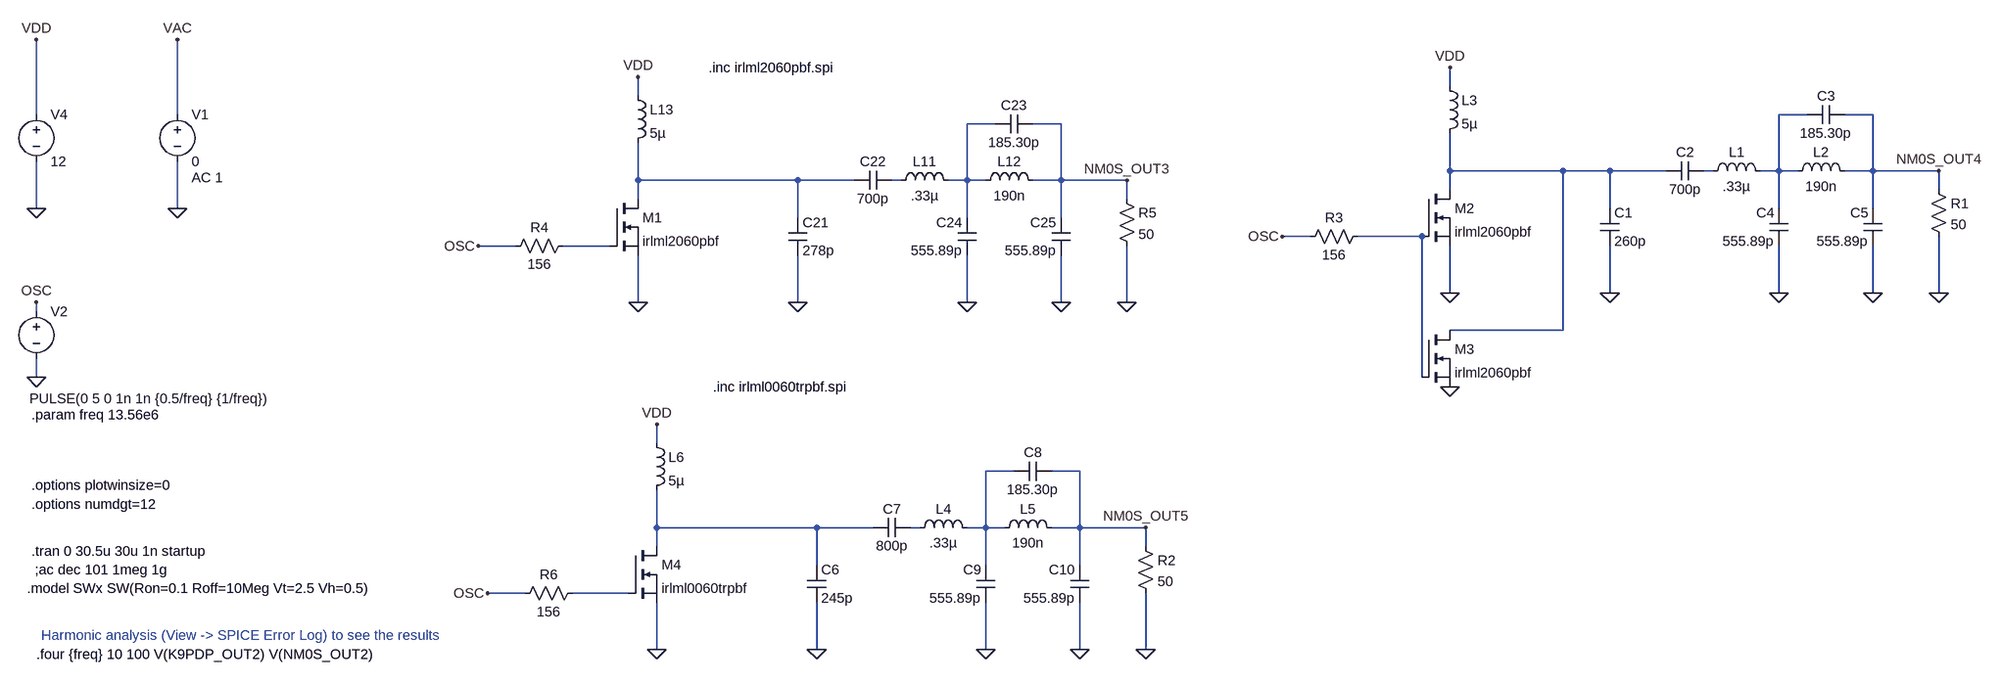
[diagram p0: schematic Class_E_with_transistor.asc]
Class_E_with_transistor.asc, the LTspice schematic file:
Version 4
SHEET 1 2636 1572
WIRE 1712 80 1712 48
WIRE 240 96 240 64
WIRE -784 128 -784 0
WIRE -544 128 -544 0
WIRE 2320 128 2272 128
WIRE 2432 128 2384 128
WIRE 848 144 800 144
WIRE 960 144 912 144
WIRE 1712 224 1712 160
WIRE 1904 224 1712 224
WIRE 1984 224 1904 224
WIRE 2080 224 1984 224
WIRE 2160 224 2144 224
WIRE 2272 224 2272 128
WIRE 2272 224 2240 224
WIRE 2304 224 2272 224
WIRE 2432 224 2432 128
WIRE 2432 224 2384 224
WIRE 2544 224 2432 224
WIRE 240 240 240 176
WIRE 512 240 240 240
WIRE 608 240 512 240
WIRE 688 240 672 240
WIRE 800 240 800 144
WIRE 800 240 768 240
WIRE 832 240 800 240
WIRE 960 240 960 144
WIRE 960 240 912 240
WIRE 1072 240 960 240
WIRE 1712 256 1712 224
WIRE 2544 256 2544 224
WIRE 240 272 240 240
WIRE 1072 272 1072 240
WIRE -784 288 -784 208
WIRE -544 288 -544 208
WIRE 1984 288 1984 224
WIRE 2272 288 2272 224
WIRE 2432 288 2432 224
WIRE 512 304 512 240
WIRE 800 304 800 240
WIRE 960 304 960 240
WIRE 1408 336 1360 336
WIRE 1664 336 1488 336
WIRE 32 352 -32 352
WIRE 192 352 112 352
WIRE 1712 432 1712 352
WIRE 1984 432 1984 352
WIRE 2272 432 2272 352
WIRE 2432 432 2432 352
WIRE 2544 432 2544 336
WIRE 240 448 240 368
WIRE 512 448 512 368
WIRE 800 448 800 368
WIRE 960 448 960 368
WIRE 1072 448 1072 352
WIRE -784 464 -784 448
WIRE 1904 496 1904 224
WIRE 1904 496 1712 496
WIRE -784 576 -784 544
WIRE 1664 576 1664 336
WIRE 272 688 272 656
WIRE 880 736 832 736
WIRE 992 736 944 736
WIRE 272 832 272 768
WIRE 544 832 272 832
WIRE 640 832 544 832
WIRE 720 832 704 832
WIRE 832 832 832 736
WIRE 832 832 800 832
WIRE 864 832 832 832
WIRE 992 832 992 736
WIRE 992 832 944 832
WIRE 1104 832 992 832
WIRE 272 864 272 832
WIRE 1104 864 1104 832
WIRE 544 896 544 832
WIRE 832 896 832 832
WIRE 992 896 992 832
WIRE 48 944 -16 944
WIRE 224 944 128 944
WIRE 272 1040 272 960
WIRE 544 1040 544 960
WIRE 832 1040 832 960
WIRE 992 1040 992 960
WIRE 1104 1040 1104 944
FLAG -544 288 0
FLAG -544 0 VAC
FLAG -784 576 0
FLAG -784 288 0
FLAG -784 0 VDD
FLAG -784 448 OSC
FLAG 512 448 0
FLAG 800 448 0
FLAG 960 448 0
FLAG 1072 448 0
FLAG 1072 240 NM0S_OUT3
FLAG 240 448 0
FLAG 240 64 VDD
FLAG -32 352 OSC
FLAG 1984 432 0
FLAG 2272 432 0
FLAG 2432 432 0
FLAG 2544 432 0
FLAG 2544 224 NM0S_OUT4
FLAG 1712 432 0
FLAG 1712 48 VDD
FLAG 1360 336 OSC
FLAG 1712 592 0
FLAG 544 1040 0
FLAG 832 1040 0
FLAG 992 1040 0
FLAG 1104 1040 0
FLAG 1104 832 NM0S_OUT5
FLAG 272 1040 0
FLAG 272 656 VDD
FLAG -16 944 OSC
SYMBOL voltage -544 112 R0
WINDOW 123 24 124 Left 2
WINDOW 39 0 0 Left 0
SYMATTR Value2 AC 1
SYMATTR InstName V1
SYMATTR Value 0
SYMBOL voltage -784 448 R0
WINDOW 123 0 0 Left 0
WINDOW 39 0 0 Left 0
WINDOW 3 -12 164 Left 2
SYMATTR Value PULSE(0 5 0 1n 1n {0.5/freq} {1/freq})
SYMATTR InstName V2
SYMBOL voltage -784 112 R0
WINDOW 123 0 0 Left 0
WINDOW 39 0 0 Left 0
SYMATTR InstName V4
SYMATTR Value 12
SYMBOL cap 496 304 R0
SYMATTR InstName C21
SYMATTR Value 278p
SYMBOL cap 672 224 R90
WINDOW 0 0 32 VBottom 2
WINDOW 3 32 32 VTop 2
SYMATTR InstName C22
SYMATTR Value 700p
SYMBOL cap 912 128 R90
WINDOW 0 0 32 VBottom 2
WINDOW 3 32 32 VTop 2
SYMATTR InstName C23
SYMATTR Value 185.30p
SYMBOL cap 816 368 R180
WINDOW 0 24 56 Left 2
WINDOW 3 24 8 Left 2
SYMATTR InstName C24
SYMATTR Value 555.89p
SYMBOL cap 976 368 R180
WINDOW 0 24 56 Left 2
WINDOW 3 24 8 Left 2
SYMATTR InstName C25
SYMATTR Value 555.89p
SYMBOL ind 672 256 R270
WINDOW 0 32 56 VTop 2
WINDOW 3 5 56 VBottom 2
SYMATTR InstName L11
SYMATTR Value .33µ
SYMBOL ind 816 256 R270
WINDOW 0 32 56 VTop 2
WINDOW 3 5 56 VBottom 2
SYMATTR InstName L12
SYMATTR Value 190n
SYMBOL res 1056 256 R0
SYMATTR InstName R5
SYMATTR Value 50
SYMBOL ind 224 80 R0
SYMATTR InstName L13
SYMATTR Value 5µ
SYMBOL nmos 192 272 R0
SYMATTR InstName M1
SYMATTR Value irlml2060pbf
SYMATTR Prefix X
SYMBOL cap 1968 288 R0
SYMATTR InstName C1
SYMATTR Value 260p
SYMBOL cap 2144 208 R90
WINDOW 0 0 32 VBottom 2
WINDOW 3 32 32 VTop 2
SYMATTR InstName C2
SYMATTR Value 700p
SYMBOL cap 2384 112 R90
WINDOW 0 0 32 VBottom 2
WINDOW 3 32 32 VTop 2
SYMATTR InstName C3
SYMATTR Value 185.30p
SYMBOL cap 2288 352 R180
WINDOW 0 24 56 Left 2
WINDOW 3 24 8 Left 2
SYMATTR InstName C4
SYMATTR Value 555.89p
SYMBOL cap 2448 352 R180
WINDOW 0 24 56 Left 2
WINDOW 3 24 8 Left 2
SYMATTR InstName C5
SYMATTR Value 555.89p
SYMBOL ind 2144 240 R270
WINDOW 0 32 56 VTop 2
WINDOW 3 5 56 VBottom 2
SYMATTR InstName L1
SYMATTR Value .33µ
SYMBOL ind 2288 240 R270
WINDOW 0 32 56 VTop 2
WINDOW 3 5 56 VBottom 2
SYMATTR InstName L2
SYMATTR Value 190n
SYMBOL res 2528 240 R0
SYMATTR InstName R1
SYMATTR Value 50
SYMBOL ind 1696 64 R0
SYMATTR InstName L3
SYMATTR Value 5µ
SYMBOL nmos 1664 256 R0
SYMATTR InstName M2
SYMATTR Value irlml2060pbf
SYMATTR Prefix X
SYMBOL nmos 1664 496 R0
SYMATTR InstName M3
SYMATTR Value irlml2060pbf
SYMATTR Prefix X
SYMBOL cap 528 896 R0
SYMATTR InstName C6
SYMATTR Value 245p
SYMBOL cap 704 816 R90
WINDOW 0 0 32 VBottom 2
WINDOW 3 32 32 VTop 2
SYMATTR InstName C7
SYMATTR Value 800p
SYMBOL cap 944 720 R90
WINDOW 0 0 32 VBottom 2
WINDOW 3 32 32 VTop 2
SYMATTR InstName C8
SYMATTR Value 185.30p
SYMBOL cap 848 960 R180
WINDOW 0 24 56 Left 2
WINDOW 3 24 8 Left 2
SYMATTR InstName C9
SYMATTR Value 555.89p
SYMBOL cap 1008 960 R180
WINDOW 0 24 56 Left 2
WINDOW 3 24 8 Left 2
SYMATTR InstName C10
SYMATTR Value 555.89p
SYMBOL ind 704 848 R270
WINDOW 0 32 56 VTop 2
WINDOW 3 5 56 VBottom 2
SYMATTR InstName L4
SYMATTR Value .33µ
SYMBOL ind 848 848 R270
WINDOW 0 32 56 VTop 2
WINDOW 3 5 56 VBottom 2
SYMATTR InstName L5
SYMATTR Value 190n
SYMBOL res 1088 848 R0
SYMATTR InstName R2
SYMATTR Value 50
SYMBOL ind 256 672 R0
SYMATTR InstName L6
SYMATTR Value 5µ
SYMBOL nmos 224 864 R0
SYMATTR InstName M4
SYMATTR Value irlml0060trpbf
SYMATTR Prefix X
SYMBOL res 1504 320 R90
WINDOW 0 0 56 VBottom 2
WINDOW 3 32 56 VTop 2
SYMATTR InstName R3
SYMATTR Value 156
SYMBOL res 128 336 R90
WINDOW 0 0 56 VBottom 2
WINDOW 3 32 56 VTop 2
SYMATTR InstName R4
SYMATTR Value 156
SYMBOL res 144 928 R90
WINDOW 0 0 56 VBottom 2
WINDOW 3 32 56 VTop 2
SYMATTR InstName R6
SYMATTR Value 156
TEXT -560 904 Right 2 !;ac dec 101 1meg 1g
TEXT -800 936 Left 2 !.model SWx SW(Ron=0.1 Roff=10Meg Vt=2.5 Vh=0.5)
TEXT -792 872 Left 2 !.tran 0 30.5u 30u 1n startup
TEXT -792 640 Left 2 !.param freq 13.56e6
TEXT -792 792 Left 2 !.options numdgt=12
TEXT -792 760 Left 2 !.options plotwinsize=0
TEXT -784 1048 Left 2 !.four {freq} 10 100 V(K9PDP_OUT2) V(NM0S_OUT2)
TEXT -776 1016 Left 2 ;Harmonic analysis (View -> SPICE Error Log) to see the results
TEXT 360 48 Left 2 !.inc irlml2060pbf.spi
TEXT 368 592 Left 2 !.inc irlml0060trpbf.spi

The netlist it stands for:
* Class_E_with_transistor.asc
V1 VAC 0 0 AC 1
V2 OSC 0 PULSE(0 5 0 1n 1n {0.5/freq} {1/freq})
V4 VDD 0 12
C21 N005 0 278p
C22 N006 N005 700p
C23 NM0S_OUT3 N002 185.30p
C24 0 N002 555.89p
C25 0 NM0S_OUT3 555.89p
L11 N006 N002 .33µ
L12 N002 NM0S_OUT3 190n
R5 NM0S_OUT3 0 50
L13 VDD N005 5µ
XM1 N005 N008 0 irlml2060pbf  ; pins D G S
C1 N003 0 260p
C2 N004 N003 700p
C3 NM0S_OUT4 N001 185.30p
C4 0 N001 555.89p
C5 0 NM0S_OUT4 555.89p
L1 N004 N001 .33µ
L2 N001 NM0S_OUT4 190n
R1 NM0S_OUT4 0 50
L3 VDD N003 5µ
XM2 N003 N007 0 irlml2060pbf  ; pins D G S
XM3 N003 N007 0 irlml2060pbf  ; pins D G S
C6 N010 0 245p
C7 N011 N010 800p
C8 NM0S_OUT5 N009 185.30p
C9 0 N009 555.89p
C10 0 NM0S_OUT5 555.89p
L4 N011 N009 .33µ
L5 N009 NM0S_OUT5 190n
R2 NM0S_OUT5 0 50
L6 VDD N010 5µ
XM4 N010 N012 0 irlml0060trpbf  ; pins D G S
R3 N007 OSC 156
R4 N008 OSC 156
R6 N012 OSC 156
;ac dec 101 1meg 1g
.model SWx SW(Ron=0.1 Roff=10Meg Vt=2.5 Vh=0.5)
.tran 0 30.5u 30u 1n startup
.param freq 13.56e6
.options numdgt=12
.options plotwinsize=0
.four {freq} 10 100 V(K9PDP_OUT2) V(NM0S_OUT2)
* Harmonic analysis (View -> SPICE Error Log) to see the results
.inc irlml2060pbf.spi
.inc irlml0060trpbf.spi
.backanno
.end